# Altium schematic sheet MACH_PHAT.SchDoc
size A
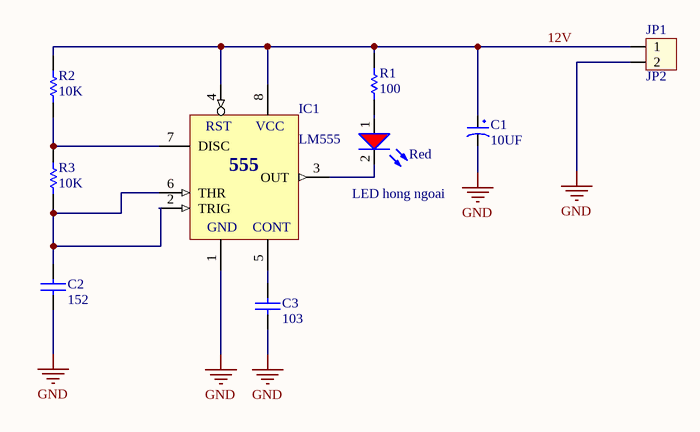
[diagram p0: MACH_PHAT.SchDoc]

## Parts
C1  10UF  [CAP_10UF_16V]
C2  value 152  [CAPNTO2.54-3.05x1.78A]  (hidden comment: 5AK102KABAA)
C3  value 103  [Tu gom 104]  (hidden comment: 5AK102KABAA)
IC1  LM555  [LM555]
JP1  JP2  [CON2]
LED_hong_ngoai  value Red  [LED5R]  (hidden comment: LT0055)
R1  10k: 100  [RES 1/4W CFR25]  (hidden comment: CF1/4W10KJ25)
R2  CF1/4W10KJ25  [RES 1/4W CFR25]  (value not drawn)
R3  CF1/4W10KJ25  [RES 1/4W CFR25]  (value not drawn)

## Nets
GND: C1.2 C2.1 C3.1 IC1.1(GND) JP1.2
12V: C1.1 IC1.4(RST) IC1.8(VCC) JP1.1 R1.2 R2.2
NetC2_2: C2.2 IC1.2(TRIG) IC1.6(THR) R3.1
NetC3_2: C3.2 IC1.5(CONT)
NetIC1_3: IC1.3(OUT) LED_hong_ngoai.2(K)
NetIC1_7: IC1.7(DISC) R2.1 R3.2
NetLED_hong_ngoai_1: LED_hong_ngoai.1(A) R1.1

## Notes on the sheet
- (in symbol LM555) 555

## Library data of the parts
C1 = CP1: Cap P  0,1uF < 22uF , 16 - 50V; Value: 10uF/50V; Description 1: 10 => 220uF/6,3V/10V - 10uF => 100uF/16V; Description 2: 0,1uF => 33uF/50V - 10uF => 22uF/63V; Description 3: 0,47uF => 10uF/100V
C2 C3 = 5AK102KABAA: CAP NPO CAPNTO 1nF 100V 10%; ComponentLink1Description: Datasheet; ComponentLink1URL: D:\Dropbox\Datasheets\Passive Components\Capacitors\AVX Disc Ceramic Capacitors.pdf; Unit Price: 0.003
IC1 = LM555: Timer; Value: LM555
JP1 = Con2: Connector 2; Value: Connector 2
LED_hong_ngoai = LT0055: LED Red 20mA 2.0V 5mm; ComponentLink1Description: Datasheet; ComponentLink1URL: D:\Dropbox\Datasheets\Opto and Illumination\LEDs\LT0055.pdf; Unit Price: 0.0077
R1-R3 = CF1/4W10KJ25: RES CF AXIAL-0.3 5% 1/4W 10K; Unit Price: 0.001; ComponentLink1Description: Datasheet; ComponentLink1URL: D:\Dropbox\Datasheets\Passive Components\Resistors\Carbon Film Resistor.pdf
  R2 R3: 10k: 10K